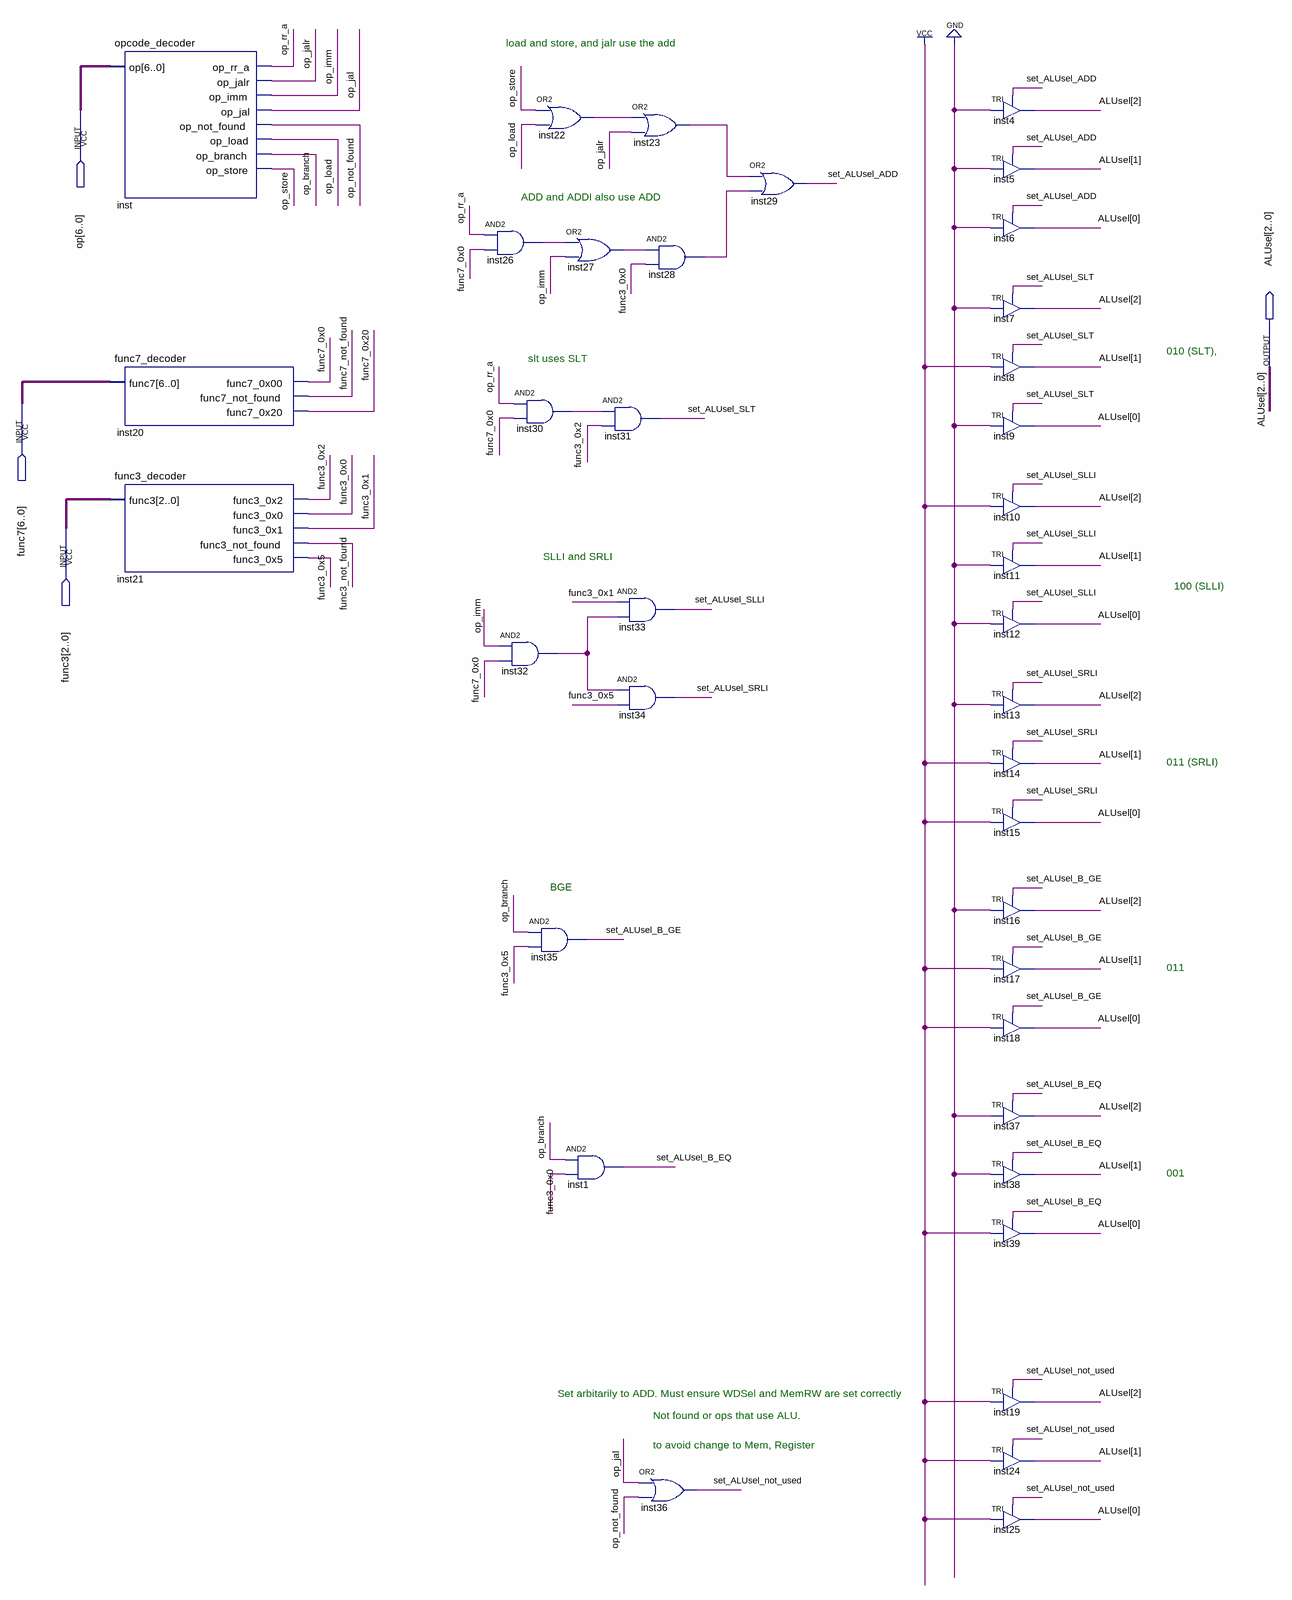
[diagram p0: schematic sheet]
// Quartus schematic ALUsel_setter.bdf as structural Verilog: 38 symbols, 4 pins
module ALUsel_setter (
  input  [6:0] op,
  input  [6:0] func7,
  input  [2:0] func3,
  output [2:0] ALUsel
);

  wire func3_0x0, func3_0x1, func3_0x2, func3_0x5, func3_not_found, func7_0x0, func7_0x20, func7_not_found,
       inst22_out, inst23_out, inst26_out, inst27_out, inst28_out, inst30_out, inst32_out, op_branch, op_imm,
       op_jal, op_jalr, op_load, op_not_found, op_rr_a, op_store, set_ALUsel_ADD, set_ALUsel_B_EQ,
       set_ALUsel_B_GE, set_ALUsel_not_used, set_ALUsel_SLLI, set_ALUsel_SLT, set_ALUsel_SRLI;

  opcode_decoder inst (
    .op(op), .op_rr_a(op_rr_a), .op_jalr(op_jalr), .op_imm(op_imm), .op_jal(op_jal),
    .op_not_found(op_not_found), .op_load(op_load), .op_branch(op_branch), .op_store(op_store));
  func7_decoder inst20 (
    .func7(func7), .func7_0x00(func7_0x0), .func7_not_found(func7_not_found), .func7_0x20(func7_0x20));
  func3_decoder inst21 (
    .func3(func3), .func3_0x2(func3_0x2), .func3_0x0(func3_0x0), .func3_0x1(func3_0x1),
    .func3_not_found(func3_not_found), .func3_0x5(func3_0x5));
  and inst26 (inst26_out, op_rr_a, func7_0x0);
  or inst22 (inst22_out, op_store, op_load);
  and inst30 (inst30_out, op_rr_a, func7_0x0);
  and inst32 (inst32_out, op_imm, func7_0x0);
  and inst35 (set_ALUsel_B_GE, op_branch, func3_0x5);
  or inst27 (inst27_out, inst26_out, op_imm);
  and inst31 (set_ALUsel_SLT, inst30_out, func3_0x2);
  and inst1 (set_ALUsel_B_EQ, op_branch, func3_0x0);
  or inst23 (inst23_out, inst22_out, op_jalr);
  and inst28 (inst28_out, inst27_out, func3_0x0);
  and inst33 (set_ALUsel_SLLI, func3_0x1, inst32_out);
  and inst34 (set_ALUsel_SRLI, inst32_out, func3_0x5);
  or inst36 (set_ALUsel_not_used, op_jal, op_not_found);
  or inst29 (set_ALUsel_ADD, inst23_out, inst28_out);
  TRI inst4 (.IN(1'b0), .OE(set_ALUsel_ADD), .OUT(ALUsel[2]));
  TRI inst5 (.IN(1'b0), .OE(set_ALUsel_ADD), .OUT(ALUsel[1]));
  TRI inst6 (.IN(1'b0), .OE(set_ALUsel_ADD), .OUT(ALUsel[0]));
  TRI inst7 (.IN(1'b0), .OE(set_ALUsel_SLT), .OUT(ALUsel[2]));
  TRI inst8 (.IN(1'b1), .OE(set_ALUsel_SLT), .OUT(ALUsel[1]));
  TRI inst9 (.IN(1'b0), .OE(set_ALUsel_SLT), .OUT(ALUsel[0]));
  TRI inst10 (.IN(1'b1), .OE(set_ALUsel_SLLI), .OUT(ALUsel[2]));
  TRI inst11 (.IN(1'b0), .OE(set_ALUsel_SLLI), .OUT(ALUsel[1]));
  TRI inst12 (.IN(1'b0), .OE(set_ALUsel_SLLI), .OUT(ALUsel[0]));
  TRI inst13 (.IN(1'b0), .OE(set_ALUsel_SRLI), .OUT(ALUsel[2]));
  TRI inst14 (.IN(1'b1), .OE(set_ALUsel_SRLI), .OUT(ALUsel[1]));
  TRI inst15 (.IN(1'b1), .OE(set_ALUsel_SRLI), .OUT(ALUsel[0]));
  TRI inst16 (.IN(1'b0), .OE(set_ALUsel_B_GE), .OUT(ALUsel[2]));
  TRI inst17 (.IN(1'b1), .OE(set_ALUsel_B_GE), .OUT(ALUsel[1]));
  TRI inst18 (.IN(1'b1), .OE(set_ALUsel_B_GE), .OUT(ALUsel[0]));
  TRI inst37 (.IN(1'b0), .OE(set_ALUsel_B_EQ), .OUT(ALUsel[2]));
  TRI inst38 (.IN(1'b0), .OE(set_ALUsel_B_EQ), .OUT(ALUsel[1]));
  TRI inst39 (.IN(1'b1), .OE(set_ALUsel_B_EQ), .OUT(ALUsel[0]));
  TRI inst19 (.IN(1'b1), .OE(set_ALUsel_not_used), .OUT(ALUsel[2]));
  TRI inst24 (.IN(1'b1), .OE(set_ALUsel_not_used), .OUT(ALUsel[1]));
  TRI inst25 (.IN(1'b1), .OE(set_ALUsel_not_used), .OUT(ALUsel[0]));

  // Notes on the sheet:
  //   load and store, and jalr use the add
  //   ADD and ADDI also use ADD
  //   010 (SLT),
  //   slt uses SLT
  //   SLLI and SRLI
  //   100 (SLLI)
  //   011 (SRLI)
  //   BGE
  //   011
  //   001
  //   Set arbitarily to ADD. Must ensure WDSel and MemRW are set correctly
  //   Not found or ops that use ALU. 
  //   to avoid change to Mem, Register
endmodule
